# Altium schematic sheet BLDC_Driver_E3.SchDoc
size 420 x 297 mm; Address1: Address1; Address2: Address2; Address3: Address3; Address4: Address4; SheetNumber: 1; Scale: 1:1; Разраб.: Лепотенко А.С.; Обозначение документа: BLDC.421232.001 Э3; Перв. применение: BLDC.421232.001; Наименование изделия 1: Драйвер BLDC; Наименование изделия 2: Схема электрическая; Наименование изделия 3: принципиальная; Нач. отд.: Нач. отд.
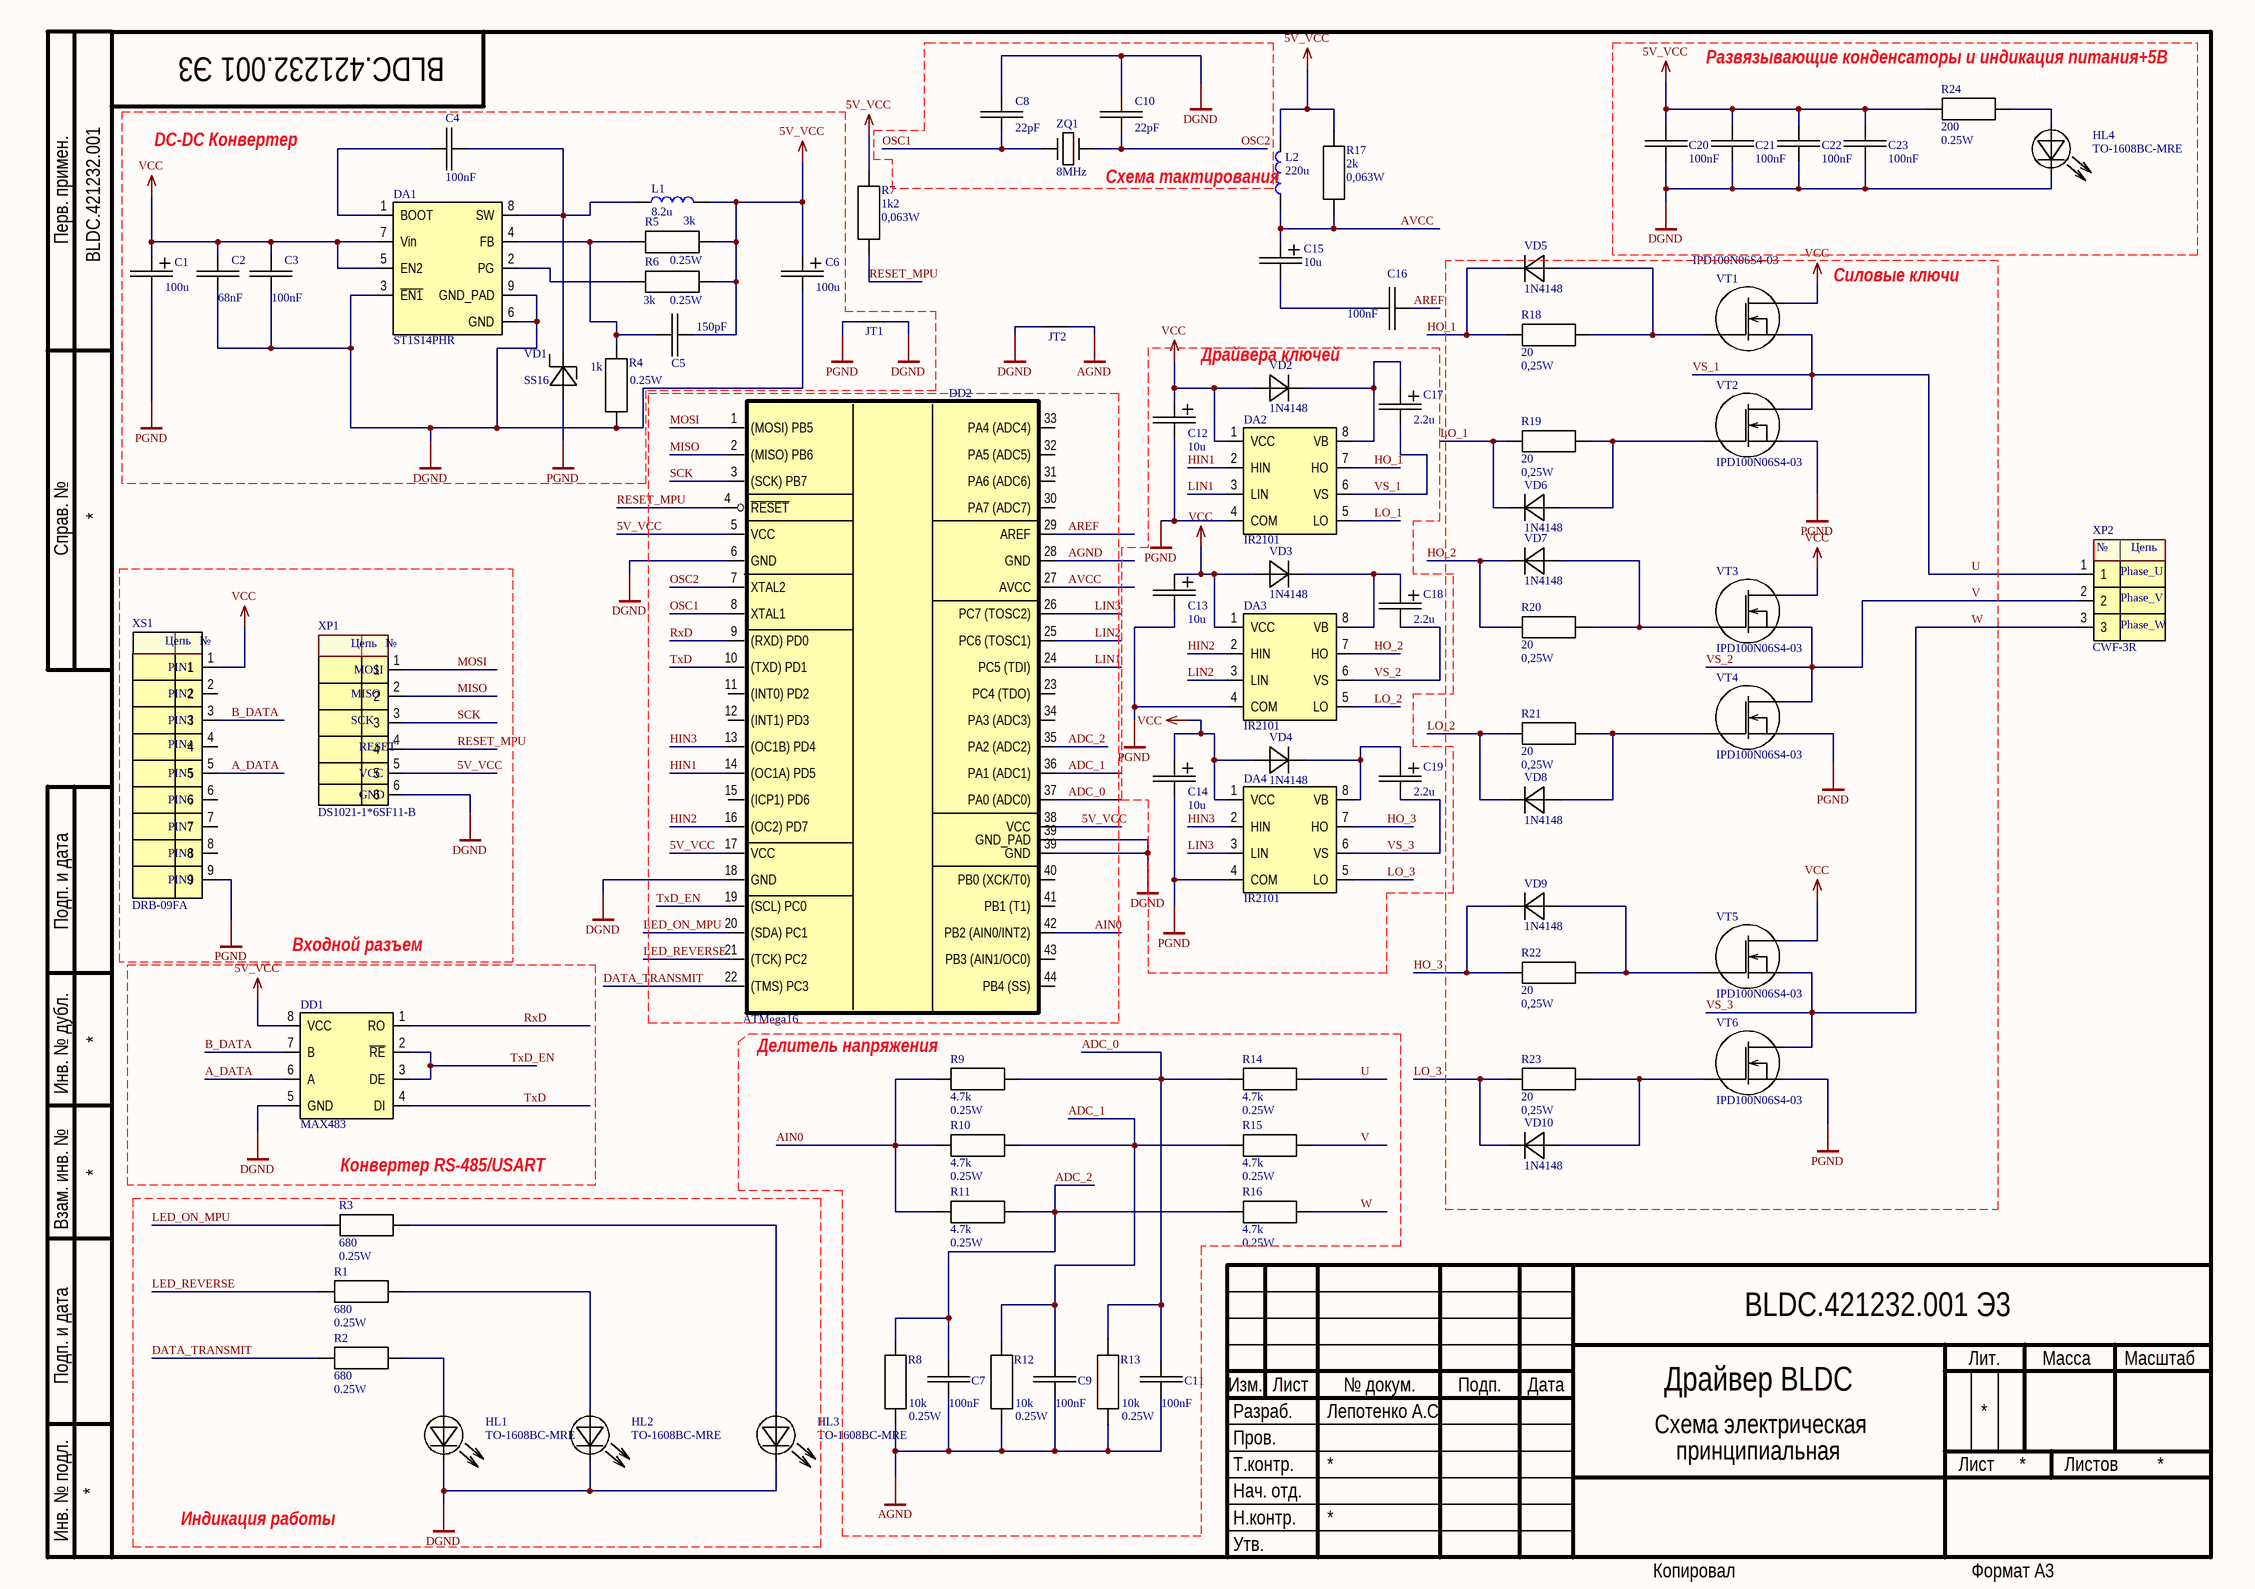
[diagram p0: BLDC_Driver_E3.SchDoc]

## Parts
C1  100u  [ECAP_8x10]
C2  68nF  [CAP1206]
C3  100nF  [CAP1206]
C4  100nF  [CAP1206]
C5  150pF  [CAP0402_min]
C6  100u  [ECAP_8x10]
C7  100nF  [CAP0402_min]
C8  22pF  [CAP0402_min]
C9  100nF  [CAP0402_min]
C10  22pF  [CAP0402_min]
C11  100nF  [CAP0402_min]
C12  10u  [Type D]
C13  10u  [Type D]
C14  10u  [Type D]
C15  10u  [CAPTtantaltypeA]
C16  100nF  [CAP0402_min]
C17  2.2u  [CAPASITOR TYPEB]
C18  2.2u  [CAPASITOR TYPEB]
C19  2.2u  [CAPASITOR TYPEB]
C20  100nF  [CAP0402_min]
C21  100nF  [CAP0402_min]
C22  100nF  [CAP0402_min]
C23  100nF  [CAP0402_min]
DA1  ST1S14PHR  [HSOP8_Termal]
DA2  IR2101  [SO-8]
DA3  IR2101  [SO-8]
DA4  IR2101  [SO-8]
DD1  MAX483  [SO-8]
DD2  ATMega16  [TQFP80P1200X1200X120-44N]
HL1  TO-1608BC-MRE  [LED1206]
HL2  TO-1608BC-MRE  [LED1206]
HL3  TO-1608BC-MRE  [LED1206]
HL4  TO-1608BC-MRE  [LED1206]
JT1  JT  [JT]  (value not drawn)  (net tie)
JT2  JT  [JT]  (value not drawn)  (net tie)
L1  8.2u  [LQH4N_1812]
L2  220u  [453232]
R1  Power: 0.25W  [1206]  (hidden comment: 680)
R2  Power: 0.25W  [1206]  (hidden comment: 680)
R3  Power: 0.25W  [1206]  (hidden comment: 680)
R4  Power: 0.25W  [1206]  (hidden comment: 1k)
R5  Power: 0.25W  [1206]  (hidden comment: 3k)
R6  Power: 0.25W  [1206]  (hidden comment: 3k)
R7  Power: 0,063W  [0402]  (hidden comment: 1k2)
R8  Power: 0.25W  [1206]  (hidden comment: 10k)
R9  Power: 0.25W  [1206]  (hidden comment: 4.7k)
R10  Power: 0.25W  [1206]  (hidden comment: 4.7k)
R11  Power: 0.25W  [1206]  (hidden comment: 4.7k)
R12  Power: 0.25W  [1206]  (hidden comment: 10k)
R13  Power: 0.25W  [1206]  (hidden comment: 10k)
R14  Power: 0.25W  [1206]  (hidden comment: 4.7k)
R15  Power: 0.25W  [1206]  (hidden comment: 4.7k)
R16  Power: 0.25W  [1206]  (hidden comment: 4.7k)
R17  Power: 0,063W  [0402]  (hidden comment: 2k)
R18  Power: 0,25W  [1206]  (hidden comment: 20)
R19  Power: 0,25W  [1206]  (hidden comment: 20)
R20  Power: 0,25W  [1206]  (hidden comment: 20)
R21  Power: 0,25W  [1206]  (hidden comment: 20)
R22  Power: 0,25W  [1206]  (hidden comment: 20)
R23  Power: 0,25W  [1206]  (hidden comment: 20)
R24  Power: 0.25W  [1206]  (hidden comment: 200)
VD1  SS16  [DO-214(SMA)]
VD2  1N4148  [SOD-23]
VD3  1N4148  [SOD-23]
VD4  1N4148  [SOD-23]
VD5  1N4148  [SOD-23]
VD6  1N4148  [SOD-23]
VD7  1N4148  [SOD-23]
VD8  1N4148  [SOD-23]
VD9  1N4148  [SOD-23]
VD10  1N4148  [SOD-23]
VT1  IPD100N06S4-03  [D2PACK]
VT2  IPD100N06S4-03  [D2PACK]
VT3  IPD100N06S4-03  [D2PACK]
VT4  IPD100N06S4-03  [D2PACK]
VT5  IPD100N06S4-03  [D2PACK]
VT6  IPD100N06S4-03  [D2PACK]
XP1  DS1021-1*6SF11-B  [PLS6x1]
XP2  CWF-3R  [CWF-3R]
XS1  DRB-09FA  [DRB-09FA]
ZQ1  8MHz  [HC-49US]

## Nets
5V_VCC: C5.2 C6.1 C20.2 C21.2 C22.2 C23.2 DD1.8(VCC) DD2.5(VCC) DD2.17(VCC) DD2.38(VCC) L1.2 L2.2 R5.2 R6.2 R7.2 R17.2 R24.2 XP1.5
AGND: C7.1 C9.1 C11.1 DD2.28(GND) JT2.2 R8.1 R12.1 R13.1
DGND: C2.1 C3.1 C6.2 C8.1 C10.1 C20.1 C21.1 C22.1 C23.1 DA1.3(~{EN1}) DA1.6(GND) DA1.9(GND_PAD) DD1.5(GND) DD2.6(GND) DD2.18(GND) DD2.39(GND) HL1.2 HL2.2 HL3.2 HL4.2 JT1.2 JT2.1 R4.1 XP1.6
PGND: C1.2 C12.2 C13.2 C14.2 DA2.4(COM) DA3.4(COM) DA4.4(COM) JT1.1 VD1.1 VT2.3(Source) VT4.3(Source) VT6.3(Source) XS1.9
VCC: C1.1 C2.2 C3.2 C12.1 C13.1 C14.1 DA1.5(EN2) DA1.7(Vin) DA2.1(VCC) DA3.1(VCC) DA4.1(VCC) VD2.1 VD3.1 VD4.1 VT1.2(D) VT3.2(D) VT5.2(D) XS1.1
A_DATA: DD1.6(A) XS1.5
ADC_0: C11.2 DD2.37(PA0_(ADC0)) R9.2 R13.2 R14.1
ADC_1: C9.2 DD2.36(PA1_(ADC1)) R10.2 R12.2 R15.1
ADC_2: C7.2 DD2.35(PA2_(ADC2)) R8.2 R11.2 R16.1
AIN0: DD2.42(PB2_(AIN0/INT2)) R9.1 R10.1 R11.1
AREF: C16.2 DD2.29(AREF)
AVCC: C15.1 DD2.27(AVCC) L2.1 R17.1
B_DATA: DD1.7(B) XS1.3
DATA_TRANSMIT: DD2.22((TMS)_PC3) R2.2
HIN1: DA2.2(HIN) DD2.14((OC1A)_PD5)
HIN2: DA3.2(HIN) DD2.16((OC2)_PD7)
HIN3: DA4.2(HIN) DD2.13((OC1B)_PD4)
HO_1: DA2.7(HO) R18.1 VD5.2
HO_2: DA3.7(HO) R20.1 VD7.2
HO_3: DA4.7(HO) R22.1 VD9.2
LED_ON_MPU: DD2.20((SDA)_PC1) R3.2
LED_REVERSE: DD2.21((TCK)_PC2) R1.2
LIN1: DA2.3(LIN) DD2.24(PC5_(TDI))
LIN2: DA3.3(LIN) DD2.25(PC6_(TOSC1))
LIN3: DA4.3(LIN) DD2.26(PC7_(TOSC2))
LO_1: DA2.5(LO) R19.1 VD6.2
LO_2: DA3.5(LO) R21.1 VD8.2
LO_3: DA4.5(LO) R23.1 VD10.2
MISO: DD2.2((MISO)_PB6) XP1.2
MOSI: DD2.1((MOSI)_PB5) XP1.1
OSC1: C8.2 DD2.8(XTAL1) ZQ1.1
OSC2: C10.2 DD2.7(XTAL2) ZQ1.3
RESET_MPU: DD2.4(~{RESET}) R7.1 XP1.4
RxD: DD1.1(RO) DD2.9((RXD)_PD0)
SCK: DD2.3((SCK)_PB7) XP1.3
TxD: DD1.4(DI) DD2.10((TXD)_PD1)
TxD_EN: DD1.2(~{RE}) DD1.3(DE) DD2.19((SCL)_PC0)
U: C17.2 DA2.6(VS) R14.2 VT1.3(Source) VT2.2(D) XP2.1  [also labelled VS_1]
V: C18.2 DA3.6(VS) R15.2 VT3.3(Source) VT4.2(D) XP2.2  [also labelled VS_2]
VS_3: C19.2 DA4.6(VS) R16.2 VT5.3(Source) VT6.2(D) XP2.3  [also labelled W]
NetC4_1: C4.1 DA1.8(SW) L1.1 VD1.2
NetC4_2: C4.2 DA1.1(BOOT)
NetC5_1: C5.1 DA1.4(FB) R4.2 R5.1
NetC15_2: C15.2 C16.1
NetC17_1: C17.1 DA2.8(VB) VD2.2
NetC18_1: C18.1 DA3.8(VB) VD3.2
NetC19_1: C19.1 DA4.8(VB) VD4.2
NetDA1_2: DA1.2(PG) R6.1
NetHL1_1: HL1.1 R2.1
NetHL2_1: HL2.1 R1.1
NetHL3_1: HL3.1 R3.1
NetHL4_1: HL4.1 R24.1
NetR18_2: R18.2 VD5.1 VT1.1(G)
NetR19_2: R19.2 VD6.1 VT2.1(G)
NetR20_2: R20.2 VD7.1 VT3.1(G)
NetR21_2: R21.2 VD8.1 VT4.1(G)
NetR22_2: R22.2 VD9.1 VT5.1(G)
NetR23_2: R23.2 VD10.1 VT6.1(G)

Not connected (* = marked no-connect by the designer): DD2 11((INT0)_PD2) 12((INT1)_PD3) 15((ICP1)_PD6) 23(PC4_(TDO)) 30(PA7_(ADC7)) 31(PA6_(ADC6)) 32(PA5_(ADC5)) 33(PA4_(ADC4)) 34(PA3_(ADC3)) 40(PB0_(XCK/T0)) 41(PB1_(T1)) 43(PB3_(AIN1/OC0)) 44(PB4_(SS)); XS1 2 4 6 7 8

## Notes on the sheet
- (near R24) Развязывающие конденсаторы и индикация питания+5В
- DC-DC Конвертер
- (near L2) Схема тактирования
- Силовые ключи
- (near VD2) Драйвера ключей
- Входной разъем
- (near R9) Делитель напряжения
- Конвертер RS-485/USART
- Индикация работы
- Перв. примен.
- Справ. №
- Подп. и дата
- Инв. № дубл.
- Взам. инв. №
- Разраб.
- Изм.
- Лист
- № докум.
- Подп.
- Дата
- Лит.
- Масса
- Масштаб
- Пров.
- Т.контр.
- Листов
- Инв. № подл.
- Утв.
- Н.контр.
- Копировал
- Формат А3
- (in symbol AVR Connector Programmer) Цепь; №; MOSI; MISO; SCK; RESET; VCC; GND
- (in symbol CWF-3R) №; Цепь; Phase_U; Phase_V; Phase_W
- (in symbol DRB-09FA) Цепь; №; PIN1; PIN2; PIN3; PIN4; PIN5; PIN6; PIN7; PIN8; PIN9

## Library data of the parts
C1 C6 = Capasitor Electrolit: Part Number: B41121A6107M000; Manufacturer: Epcos; Power: 50V; Value: 100u; Price: 0,09; ShoppingPlace: https://www.ru-chipdip.by/product/b41121a6107m000; Package: ECAP8x10; Quantity: 50
C2 = Capasitor: Part Number: GRM31C5C1H683JA01L; Manufacturer: Murata; Voltage: 100V; Value: 68nF; Quantity: 20; Package: 1206; Price: 0,6; ShoppingPlace: https://www.ru-chipdip.by/product/grm31c5c1h683ja01l
C3 C4 = Capasitor: Part Number: GRM31CR72A104KW03L; Manufacturer: Murata; Voltage: 100V; Value: 100nF; Quantity: 20; Package: 1206; Price: 0,6; ShoppingPlace: https://www.ru-chipdip.by/product/grm31cr72a104k
C5 = Capasitor: Part Number: GRM1555C1H151JA01D; Manufacturer: Murata; Voltage: 50V; Value: 150pF; Quantity: 50; Package: 0402; Price: 0,02; ShoppingPlace: https://www.ru-chipdip.by/product/grm1555c1h151j
C7 C9 C11 C16 C20-C23 = Capasitor: Part Number: GRM155R71C104KA88B; Manufacturer: Murata; Voltage: 16V; Value: 100nF; Quantity: 100; Package: 0402; Price: 0,025; ShoppingPlace: https://www.ru-chipdip.by/product/grm155r71c104k
C8 C10 = Capasitor: Part Number: CL05C220JB5NNNC; Manufacturer: Samsung; Voltage: 50V; Value: 22pF; Quantity: 20; Package: 0402; Price: 0,15; ShoppingPlace: http://belchip.by/product/?selected_product=18843
C12-C14 = Capasitor Electrolit: Part Number: TECAP10/25VD20; Manufacturer: Китай; Power: 25V; Value: 10u; Price: 0,5; ShoppingPlace: https://www.ru-chipdip.by/product0/917720288; Package: TypeD
C15 = Capasitor Electrolit: Part Number: TECAP10/10VA10; Manufacturer: Китай; Power: 10V; Value: 10u; Price: 0,13; ShoppingPlace: https://www.ru-chipdip.by/product0/868717967; Package: TypeA; Quantity: 20
C17-C19 = Capasitor Electrolit: Part Number: TECAP2.2/25VB20; Manufacturer: China; Power: 25V; Value: 2.2u; Price: 0,19; ShoppingPlace: https://www.ru-chipdip.by/product0/27589; Package: Type B; quantity: 20
DA1 = ST1S14PHR: Manufacturer: STM MicroElectronics; Value: *; Part Number: ST1S14PHR; Package: HSOP8; Price: 2,95; ShoppingPlace: https://www.ru-chipdip.by/product/st1s14phr; Quantity: 1; Documentation: http://docs-europe.electrocomponents.com/webdocs/133a/0900766b8133a6fb.pdf
DA2-DA4 = IR2101: Part Number: IR2101SPBF; Manufacture: Internation Rectifier; Value: 10-20VDC; Package: SO-8; Price: 0,8; Quantity: 15; ShoppingPlace: https://www.ru-chipdip.by/product/ir2101s; Documentation: https://www.infineon.com/dgdl/ir2101.pdf?fileId=5546d462533600a4015355c7a755166c
DD1 = MAX483: Manufacture: Maxim Integreted; Part Number: MAX483; Package: SO-8; Value: *; Price: *; Quantity: *; ShoppingPlace: http://belchip.by/product/?selected_product=29121
DD2 = ATMega 16: Manufacturer: ATmel; Package: TQFP-44; Value: *; Documentation: http://ww1.microchip.com/downloads/en/DeviceDoc/doc2466.pdf; Price: 12; ShoppingPlace: http://belchip.by/product/?selected_product=07112; Quantity: 1; Part Number: ATMega16
HL1-HL4 = LED: Manufacturer: Taiwan Oasis Technology Co.,; Value: RED; Part Number: TO-1608BC-MRE; Price: 0,06; Package: 1206; Quantity: 20; ShoppingPlace: https://www.ru-chipdip.by/product/to-1608bc-mre
L1 = Inductor: Part Number: LQH4N8R2K04; Manufacturer: Murata Manufacturing; Value: 8.2u; ShoppingPlace: https://www.ru-chipdip.by/product/lqh4n8r2k04; Price: 0.3; Package: 1812; Quantity: 6; Documentation: https://static.chipdip.ru/lib/052/DOC000052641.pdf
L2 = Inductor: Part Number: CM453232-221KL; Manufacturer: Bourns; Value: 220u; ShoppingPlace: https://www.ru-chipdip.by/product/cm453232-221kl; Price: 0.225; Package: 1812; Quantity: 2
R1-R3 = Resistor: Manufacturer: Тайвань; Part Number: RC1206FR-07200RL; Quntity: 59; Price: 0,015; Package: 1206; ShoppingPlace: https://www.ru-chipdip.by/product0/9000079898; Value: 680
R4 = Resistor: Manufacturer: Taiwan Co; Part Number: RC1206FR-071KL; Quntity: 50; Price: 0,015; Package: 1206; ShoppingPlace: https://www.ru-chipdip.by/product0/9000079635; Value: 1k
R5 R6 = Resistor: Manufacturer: Taiwan Co; Part Number: RC1206FR-073KL; Quntity: 50; Price: 0,015; Package: 1206; ShoppingPlace: https://www.ru-chipdip.by/product0/9000079646; Value: 3k
R7 = Resistor: Manufacturer: YAGEO; Part Number: RC04021k2; Quntity: 1; Price: 0,15; Package: 0402; ShoppingPlace: http://belchip.by/product/?selected_product=32518; Value: 1k2
R8 R12 R13 = Resistor: Manufacturer: Taiwan Co; Part Number: RC1206JR-0710KL; Quntity: 60; Price: 0,015; Package: 1206; ShoppingPlace: https://www.ru-chipdip.by/product0/179631946; Value: 10k
R9-R11 R14-R16 = Resistor: Manufacturer: Taiwan Co; Part Number: RC1206FR-074K7L; Quntity: 60; Price: 0,015; Package: 1206; ShoppingPlace: https://www.ru-chipdip.by/product0/9000079651; Value: 4.7k
R17 = Resistor: Manufacturer: Тайвань; Part Number: RC0402FR-072KL; Quntity: 100; Price: 0,015; Package: 0402; ShoppingPlace: https://www.ru-chipdip.by/product0/9000189809; Value: 2k
R18-R23 = Resistor: Manufacturer: Taivan CO; Part Number: RC1206FR-0720RL; Quntity: 100; Price: 0,015; Package: 1206; ShoppingPlace: https://www.ru-chipdip.by/product0/9000079866; Value: 20
R24 = Resistor: Manufacturer: Тайвань; Part Number: RC1206FR-07680RL; Quntity: 59; Price: 0,015; Package: 1206; ShoppingPlace: https://www.ru-chipdip.by/product0/9000079631; Value: 200
VD1 = Basic_Diode_shottki: Manufacturer: MIC; Value: 1A,60V; Part Number: SS16; Package: SMA; Quantity: 1; Price: 0,05; ShoppingPlace: http://belchip.by/product/?selected_product=30374; Documentation: http://belchip.by/sitedocs/ss10.pdf
VD2-VD10 = Basic_Diode: Value: 100V 150mA; Part Number: 1N4148; Package: SOD-123; Quantity: 10; Price: 0,035; ShoppingPlace: https://www.ru-chipdip.by/product/1n4148w-5; Documentation: https://static.chipdip.ru/lib/008/DOC003008077.pdf
VT1-VT6 = IPD100N06S4-03: Manufacturer: Infinion; Value: 100А, 60В; Price: 1.5; ShoppingPlace: http://belchip.by/product/?selected_product=33940; Package: D2PАK; Quantity: 1; Part Number: IPD100N06S4-03; Documentation: https://ru.mouser.com/datasheet/2/196/Infineon-IPD100N06S4_03-DS-v01_00-en-1227019.pdf
XP1 = AVR Connector Programmer: Manufacturer: ROhs; Value: 500VAC; Part Number: DS1021-1*6SF11-B; Price: 0,09; Quantity: 20; shoppingPlace: https://www.ru-chipdip.by/product/pls-6?from=suggest_product; Package: 6SF11-B; Documentation: https://static.chipdip.ru/lib/227/DOC000227157.pdf
XP2 = CWF-3R: Manufacturer: KLS; Package: CWF-3R; Part Number: CWF-3R; Value: *; Quantity: 3; Price: 0.05; ShoppingPlace: http://belchip.by/product/?selected_product=32444
XS1 = DRB-09FA: Manufacturer: KLS; Value: 250V,1.5A; Part Number: DRB-09FA; Price: 0,35; Quantity: 1; shoppingPlace: http://belchip.by/product/?selected_product=03408; Documentation: http://belchip.by/sitedocs/00003408.pdf
ZQ1 = Rzanator: Part Number: 8.000MHzHC-49US; Manufacturer: CHina; Value: 8MHz; Package: HC-49US; Quantity: 7; Price: 0,15; ShoppingPlace: https://www.ru-chipdip.by/product/8mhz-hc-49s